# Altium schematic sheet AVR_ISP_Adaptor.SchDoc
size A4; Organization: ENEL429 Group N; Address1: ECE Department; Address2: University of Canterbury; Address3: Christchurch 8041; Address4: New Zealand; Revision: 1
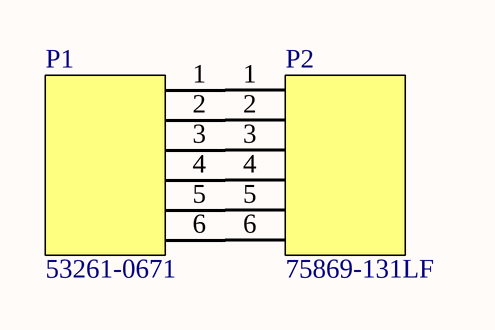
[diagram p0: AVR_ISP_Adaptor.SchDoc]

## Parts
P1  53261-0671  [53261-0671]
P2  75869-131LF  [75869-131LF]

## Nets
NetP1_1: P1.1 P2.1
NetP1_2: P1.2 P2.2
NetP1_3: P1.3 P2.3
NetP1_4: P1.4 P2.4
NetP1_5: P1.5 P2.5
NetP1_6: P1.6 P2.6

## Notes on the sheet
- Title
- Drawn by:
- Date:
- Time:
- Revision:
- Sheet
- of
- File:

## Library data of the parts
P1 = 53261-0671: CONN HEADER 6POS 1.25MM R/A SMD; Manufacturer: Molex Inc; Connector Type: Header, Male Blades; Number of Positions: 6; Pitch: 0.049" (1.25mm); Supplier 1: Digi-Key; Manufacturer Part Number: 53261-0671; RoHS: RoHS Compliant; Category: Connectors, Interconnects; Stock 1: 6997; Pricing 1: 1=1.92, 10=1.589, 50=1.327, 100=1.1772, 250=1.03276, 500=0.94178 (USD); Connector Style: -; Mounting Type: Surface Mount, Right Angle; Termination: Solder; Wire Gauge: -; Features: -; Color: Natural; Packaging: Cut Tape (CT); ComponentLink1URL: http://www.molex.com/pdm_docs/sd/532610671_sd.pdf; ComponentLink1Description: http://www.molex.com/pdm_docs/sd/532610671_sd.pdf; Supplier Part Number 1: WM7624CT-ND
P2 = 75869-131LF: CONN HEADER 6POS DUAL VERT PCB; Manufacturer: FCI; Connector Type: Header, Shrouded; Number of Positions: 6; Number of Positions Loaded: All; Pitch: 0.100" (2.54mm); Manufacturer Part Number: 75869-131LF; RoHS: RoHS Compliant; Category: Connectors, Interconnects; Contact Type: Male Pin; Number of Rows: 2; Row Spacing: 0.100" (2.54mm); Contact Mating Length: 0.236" (6.00mm); Mounting Type: Through Hole; Termination: Solder; Fastening Type: -; Features: -; Contact Finish: Gold, GXT™; Contact Finish Thickness: 30µin (0.76µm); Color: Blue; Packaging: Tube; ComponentLink1URL: http://portal.fciconnect.com/res/en/pdffiles/doc_search/75869.pdf; ComponentLink1Description: http://portal.fciconnect.com/res/en/pdffiles/doc_search/75869.pdf; Supplier 1: Digi-Key; Supplier Part Number 1: 609-2845-ND